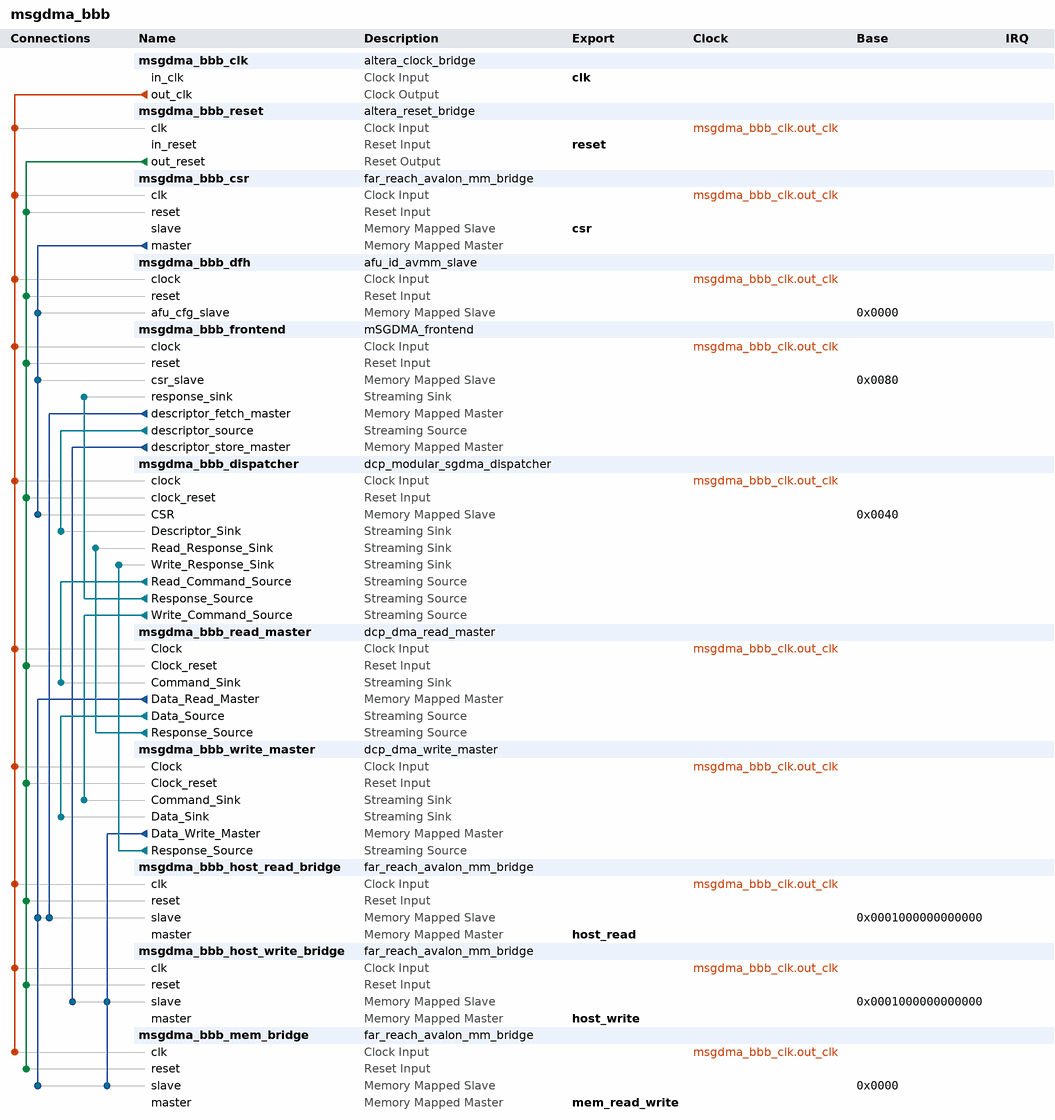
[diagram p0: system contents]
# Platform Designer (Qsys) system msgdma_bbb, Stratix 10 1SX280HN2F43E2VG
# Parameters at their usual value, and those the tool derives, are not listed.
package require -exact qsys 1.0
create_system msgdma_bbb
set_project_property DEVICE_FAMILY {Stratix 10}
set_project_property DEVICE 1SX280HN2F43E2VG

add_component msgdma_bbb_clk ip/msgdma_bbb/msgdma_bbb_clk.ip altera_clock_bridge msgdma_bbb_clk 19.1
load_component msgdma_bbb_clk
set_component_parameter_value DERIVED_CLOCK_RATE 250000000
set_component_parameter_value EXPLICIT_CLOCK_RATE 0
save_component

add_component msgdma_bbb_reset ip/msgdma_bbb/msgdma_bbb_reset.ip altera_reset_bridge msgdma_bbb_reset 17.1
load_component msgdma_bbb_reset
set_component_parameter_value ACTIVE_LOW_RESET 0
set_component_parameter_value SYNCHRONOUS_EDGES both
set_component_parameter_value SYNC_RESET 0
save_component

add_component msgdma_bbb_csr ip/msgdma_bbb/msgdma_bbb_csr.ip far_reach_avalon_mm_bridge msgdma_bbb_csr 1.0
load_component msgdma_bbb_csr
set_component_parameter_value DATA_WIDTH 64
set_component_parameter_value ADDRESS_WIDTH 8
set_component_parameter_value BURST_COUNT 1
set_component_parameter_value BURST_WIDTH 1
set_component_parameter_value RESPONSE_ENABLE 0
set_component_parameter_value READ_ENABLE 1
set_component_parameter_value MAX_PENDING_READS 4
set_component_parameter_value WRITE_ENABLE 1
set_component_parameter_value MAX_PENDING_WRITES 64
set_component_parameter_value WRITE_TRACKING_ENABLE 0
set_component_parameter_value DOWNSTREAM_PIPELINE_STAGES 1
set_component_parameter_value WAITREQUEST_PIPELINE_STAGES 1
set_component_parameter_value UPSTREAM_PIPELINE_STAGES 1
set_component_parameter_value SKID_FIFO_DEPTH 8
set_component_parameter_value SKID_FIFO_ALMOST_FULL_LEVEL 5
set_component_parameter_value SKID_FIFO_CLOCK_CROSSING_ENABLE 0
set_component_parameter_value UPSTREAM_CLOCK_CROSSING_ENABLE 0
set_component_parameter_value UPSTREAM_FIFO_DEPTH 32
set_component_parameter_value UPSTREAM_FIFO_ALMOST_FULL_LEVEL 10
save_component

add_component msgdma_bbb_dfh ip/msgdma_bbb/msgdma_bbb_dfh.ip afu_id_avmm_slave msgdma_bbb_dfh 1.0
load_component msgdma_bbb_dfh
set_component_parameter_value AFU_ID_H 17258601878618128636
set_component_parameter_value AFU_ID_L 12183532447502041578
set_component_parameter_value DFH_FEATURE_TYPE 2
set_component_parameter_value DFH_AFU_MINOR_REV 0
set_component_parameter_value DFH_AFU_MAJOR_REV 0
set_component_parameter_value DFH_END_OF_LIST 0
set_component_parameter_value DFH_NEXT_OFFSET 256
set_component_parameter_value DFH_FEATURE_ID 0
set_component_parameter_value NEXT_AFU_OFFSET 0
set_component_parameter_value CREATE_SCRATCH_REG 0
save_component

add_component msgdma_bbb_frontend ip/msgdma_bbb/msgdma_bbb_frontend.ip mSGDMA_frontend msgdma_bbb_frontend 1.0
load_component msgdma_bbb_frontend
set_component_parameter_value ADDRESS_WIDTH 49
set_component_parameter_value BURST_WIDTH 3
set_component_parameter_value FETCH_FIFO_DEPTH_LOG2 7
set_component_parameter_value STORE_FIFO_DEPTH_LOG2 5
set_component_parameter_value IRQ_ENABLE 0
save_component

add_component msgdma_bbb_dispatcher ip/msgdma_bbb/msgdma_bbb_dispatcher.ip dcp_modular_sgdma_dispatcher msgdma_bbb_dispatcher 17.0
load_component msgdma_bbb_dispatcher
set_component_parameter_value PREFETCHER_USE_CASE 1
set_component_parameter_value MODE 0
set_component_parameter_value GUI_RESPONSE_PORT 0
set_component_parameter_value RESPONSE_PORT 1
set_component_parameter_value DESCRIPTOR_INTERFACE 1
set_component_parameter_value DESCRIPTOR_FIFO_DEPTH 128
set_component_parameter_value ENHANCED_FEATURES 1
set_component_parameter_value DESCRIPTOR_WIDTH 256
set_component_parameter_value DESCRIPTOR_BYTEENABLE_WIDTH 32
set_component_parameter_value CSR_ADDRESS_WIDTH 3
set_component_parameter_value DATA_WIDTH 32
set_component_parameter_value DATA_WIDTH_DERIVED 2
set_component_parameter_value DATA_FIFO_DEPTH 32
set_component_parameter_value DATA_FIFO_DEPTH_DERIVED 1
set_component_parameter_value MAX_BYTE 1024
set_component_parameter_value MAX_BYTE_DERIVED 0
set_component_parameter_value TRANSFER_TYPE {Aligned Accesses}
set_component_parameter_value TRANSFER_TYPE_DERIVED 1
set_component_parameter_value BURST_ENABLE 0
set_component_parameter_value MAX_BURST_COUNT 2
set_component_parameter_value MAX_BURST_COUNT_DERIVED 0
set_component_parameter_value BURST_WRAPPING_SUPPORT 0
set_component_parameter_value STRIDE_ENABLE 0
set_component_parameter_value STRIDE_ENABLE_DERIVED 0
set_component_parameter_value MAX_STRIDE 1
set_component_parameter_value MAX_STRIDE_DERIVED 0
set_component_parameter_value PROGRAMMABLE_BURST_ENABLE 0
set_component_parameter_value CHANNEL_ENABLE 0
set_component_parameter_value CHANNEL_WIDTH 8
set_component_parameter_value CHANNEL_WIDTH_DERIVED 7
set_component_parameter_value ERROR_ENABLE 0
set_component_parameter_value ERROR_WIDTH 8
set_component_parameter_value ERROR_WIDTH_DERIVED 7
set_component_parameter_value PACKET_ENABLE 0
set_component_parameter_value DESCRIPTOR_FIFO_DEPTH_DERIVED 4
save_component

add_component msgdma_bbb_read_master ip/msgdma_bbb/msgdma_bbb_read_master.ip dcp_dma_read_master msgdma_bbb_read_master 17.1
load_component msgdma_bbb_read_master
set_component_parameter_value DATA_WIDTH 512
set_component_parameter_value LENGTH_WIDTH 31
set_component_parameter_value FIFO_DEPTH 128
set_component_parameter_value USE_FIX_ADDRESS_WIDTH 1
set_component_parameter_value FIX_ADDRESS_WIDTH 49
set_component_parameter_value STRIDE_ENABLE 0
set_component_parameter_value GUI_STRIDE_WIDTH 1
set_component_parameter_value BURST_ENABLE 1
set_component_parameter_value GUI_MAX_BURST_COUNT 4
set_component_parameter_value GUI_PROGRAMMABLE_BURST_ENABLE 0
set_component_parameter_value GUI_BURST_WRAPPING_SUPPORT 1
set_component_parameter_value TRANSFER_TYPE {Full Word Accesses Only}
set_component_parameter_value PACKET_ENABLE 0
set_component_parameter_value ERROR_ENABLE 0
set_component_parameter_value ERROR_WIDTH 8
set_component_parameter_value CHANNEL_ENABLE 0
set_component_parameter_value CHANNEL_WIDTH 8
set_component_parameter_value BYTE_ENABLE_WIDTH 64
set_component_parameter_value BYTE_ENABLE_WIDTH_LOG2 6
set_component_parameter_value ADDRESS_WIDTH 49
set_component_parameter_value FIFO_DEPTH_LOG2 7
set_component_parameter_value SYMBOL_WIDTH 8
set_component_parameter_value NUMBER_OF_SYMBOLS 64
set_component_parameter_value NUMBER_OF_SYMBOLS_LOG2 6
set_component_parameter_value MAX_BURST_COUNT_WIDTH 3
set_component_parameter_value UNALIGNED_ACCESSES_ENABLE 0
set_component_parameter_value ONLY_FULL_ACCESS_ENABLE 1
set_component_parameter_value BURST_WRAPPING_SUPPORT 1
set_component_parameter_value PROGRAMMABLE_BURST_ENABLE 0
set_component_parameter_value MAX_BURST_COUNT 4
set_component_parameter_value FIFO_SPEED_OPTIMIZATION 1
set_component_parameter_value STRIDE_WIDTH 1
save_component

add_component msgdma_bbb_write_master ip/msgdma_bbb/msgdma_bbb_write_master.ip dcp_dma_write_master msgdma_bbb_write_master 17.0
load_component msgdma_bbb_write_master
set_component_parameter_value DATA_WIDTH 512
set_component_parameter_value GUI_NO_BYTEENABLES 1
set_component_parameter_value LENGTH_WIDTH 32
set_component_parameter_value FIFO_DEPTH 128
set_component_parameter_value USE_FIX_ADDRESS_WIDTH 1
set_component_parameter_value FIX_ADDRESS_WIDTH 49
set_component_parameter_value STRIDE_ENABLE 0
set_component_parameter_value GUI_STRIDE_WIDTH 1
set_component_parameter_value BURST_ENABLE 1
set_component_parameter_value GUI_MAX_BURST_COUNT 4
set_component_parameter_value GUI_PROGRAMMABLE_BURST_ENABLE 0
set_component_parameter_value GUI_BURST_WRAPPING_SUPPORT 1
set_component_parameter_value TRANSFER_TYPE {Full Word Accesses Only}
set_component_parameter_value PACKET_ENABLE 0
set_component_parameter_value ERROR_ENABLE 0
set_component_parameter_value ERROR_WIDTH 8
set_component_parameter_value BYTE_ENABLE_WIDTH 64
set_component_parameter_value BYTE_ENABLE_WIDTH_LOG2 6
set_component_parameter_value NO_BYTEENABLES 0
set_component_parameter_value ADDRESS_WIDTH 49
set_component_parameter_value FIFO_DEPTH_LOG2 7
set_component_parameter_value SYMBOL_WIDTH 8
set_component_parameter_value NUMBER_OF_SYMBOLS 64
set_component_parameter_value NUMBER_OF_SYMBOLS_LOG2 6
set_component_parameter_value MAX_BURST_COUNT_WIDTH 3
set_component_parameter_value UNALIGNED_ACCESSES_ENABLE 0
set_component_parameter_value ONLY_FULL_ACCESS_ENABLE 1
set_component_parameter_value BURST_WRAPPING_SUPPORT 1
set_component_parameter_value PROGRAMMABLE_BURST_ENABLE 0
set_component_parameter_value MAX_BURST_COUNT 4
set_component_parameter_value FIFO_SPEED_OPTIMIZATION 1
set_component_parameter_value STRIDE_WIDTH 1
set_component_parameter_value ACTUAL_BYTES_TRANSFERRED_WIDTH 32
save_component

add_component msgdma_bbb_host_read_bridge ip/msgdma_bbb/msgdma_bbb_host_read_bridge.ip far_reach_avalon_mm_bridge msgdma_bbb_host_read_bridge 1.0
load_component msgdma_bbb_host_read_bridge
set_component_parameter_value DATA_WIDTH 512
set_component_parameter_value ADDRESS_WIDTH 48
set_component_parameter_value BURST_COUNT 4
set_component_parameter_value BURST_WIDTH 3
set_component_parameter_value RESPONSE_ENABLE 0
set_component_parameter_value READ_ENABLE 1
set_component_parameter_value MAX_PENDING_READS 64
set_component_parameter_value WRITE_ENABLE 0
set_component_parameter_value MAX_PENDING_WRITES 64
set_component_parameter_value WRITE_TRACKING_ENABLE 0
set_component_parameter_value DOWNSTREAM_PIPELINE_STAGES 1
set_component_parameter_value WAITREQUEST_PIPELINE_STAGES 1
set_component_parameter_value UPSTREAM_PIPELINE_STAGES 1
set_component_parameter_value SKID_FIFO_DEPTH 8
set_component_parameter_value SKID_FIFO_ALMOST_FULL_LEVEL 5
set_component_parameter_value SKID_FIFO_CLOCK_CROSSING_ENABLE 0
set_component_parameter_value UPSTREAM_CLOCK_CROSSING_ENABLE 0
set_component_parameter_value UPSTREAM_FIFO_DEPTH 32
set_component_parameter_value UPSTREAM_FIFO_ALMOST_FULL_LEVEL 10
save_component

add_component msgdma_bbb_host_write_bridge ip/msgdma_bbb/msgdma_bbb_host_write_bridge.ip far_reach_avalon_mm_bridge msgdma_bbb_host_write_bridge 1.0
load_component msgdma_bbb_host_write_bridge
set_component_parameter_value DATA_WIDTH 512
set_component_parameter_value ADDRESS_WIDTH 48
set_component_parameter_value BURST_COUNT 4
set_component_parameter_value BURST_WIDTH 3
set_component_parameter_value RESPONSE_ENABLE 1
set_component_parameter_value READ_ENABLE 0
set_component_parameter_value MAX_PENDING_READS 64
set_component_parameter_value WRITE_ENABLE 1
set_component_parameter_value MAX_PENDING_WRITES 64
set_component_parameter_value WRITE_TRACKING_ENABLE 1
set_component_parameter_value DOWNSTREAM_PIPELINE_STAGES 1
set_component_parameter_value WAITREQUEST_PIPELINE_STAGES 1
set_component_parameter_value UPSTREAM_PIPELINE_STAGES 1
set_component_parameter_value SKID_FIFO_DEPTH 8
set_component_parameter_value SKID_FIFO_ALMOST_FULL_LEVEL 5
set_component_parameter_value SKID_FIFO_CLOCK_CROSSING_ENABLE 0
set_component_parameter_value UPSTREAM_CLOCK_CROSSING_ENABLE 0
set_component_parameter_value UPSTREAM_FIFO_DEPTH 32
set_component_parameter_value UPSTREAM_FIFO_ALMOST_FULL_LEVEL 10
save_component

add_component msgdma_bbb_mem_bridge ip/msgdma_bbb/msgdma_bbb_mem_bridge.ip far_reach_avalon_mm_bridge msgdma_bbb_mem_bridge 1.0
load_component msgdma_bbb_mem_bridge
set_component_parameter_value DATA_WIDTH 512
set_component_parameter_value ADDRESS_WIDTH 48
set_component_parameter_value BURST_COUNT 4
set_component_parameter_value BURST_WIDTH 3
set_component_parameter_value RESPONSE_ENABLE 0
set_component_parameter_value READ_ENABLE 1
set_component_parameter_value MAX_PENDING_READS 64
set_component_parameter_value WRITE_ENABLE 1
set_component_parameter_value MAX_PENDING_WRITES 64
set_component_parameter_value WRITE_TRACKING_ENABLE 0
set_component_parameter_value DOWNSTREAM_PIPELINE_STAGES 1
set_component_parameter_value WAITREQUEST_PIPELINE_STAGES 1
set_component_parameter_value UPSTREAM_PIPELINE_STAGES 1
set_component_parameter_value SKID_FIFO_DEPTH 8
set_component_parameter_value SKID_FIFO_ALMOST_FULL_LEVEL 5
set_component_parameter_value SKID_FIFO_CLOCK_CROSSING_ENABLE 0
set_component_parameter_value UPSTREAM_CLOCK_CROSSING_ENABLE 0
set_component_parameter_value UPSTREAM_FIFO_DEPTH 32
set_component_parameter_value UPSTREAM_FIFO_ALMOST_FULL_LEVEL 10
save_component

# connections
add_connection msgdma_bbb_clk.out_clk msgdma_bbb_csr.clk clock
add_connection msgdma_bbb_clk.out_clk msgdma_bbb_dfh.clock clock
add_connection msgdma_bbb_clk.out_clk msgdma_bbb_dispatcher.clock clock
add_connection msgdma_bbb_clk.out_clk msgdma_bbb_frontend.clock clock
add_connection msgdma_bbb_clk.out_clk msgdma_bbb_host_read_bridge.clk clock
add_connection msgdma_bbb_clk.out_clk msgdma_bbb_host_write_bridge.clk clock
add_connection msgdma_bbb_clk.out_clk msgdma_bbb_mem_bridge.clk clock
add_connection msgdma_bbb_clk.out_clk msgdma_bbb_read_master.Clock clock
add_connection msgdma_bbb_clk.out_clk msgdma_bbb_reset.clk clock
add_connection msgdma_bbb_clk.out_clk msgdma_bbb_write_master.Clock clock
add_connection msgdma_bbb_reset.out_reset msgdma_bbb_csr.reset reset
add_connection msgdma_bbb_reset.out_reset msgdma_bbb_dfh.reset reset
add_connection msgdma_bbb_reset.out_reset msgdma_bbb_dispatcher.clock_reset reset
add_connection msgdma_bbb_reset.out_reset msgdma_bbb_frontend.reset reset
add_connection msgdma_bbb_reset.out_reset msgdma_bbb_host_read_bridge.reset reset
add_connection msgdma_bbb_reset.out_reset msgdma_bbb_host_write_bridge.reset reset
add_connection msgdma_bbb_reset.out_reset msgdma_bbb_mem_bridge.reset reset
add_connection msgdma_bbb_reset.out_reset msgdma_bbb_read_master.Clock_reset reset
add_connection msgdma_bbb_reset.out_reset msgdma_bbb_write_master.Clock_reset reset
add_connection msgdma_bbb_csr.master msgdma_bbb_dfh.afu_cfg_slave avalon
set_connection_parameter_value msgdma_bbb_csr.master/msgdma_bbb_dfh.afu_cfg_slave baseAddress 0x0000
add_connection msgdma_bbb_csr.master msgdma_bbb_dispatcher.CSR avalon
set_connection_parameter_value msgdma_bbb_csr.master/msgdma_bbb_dispatcher.CSR baseAddress 0x0040
add_connection msgdma_bbb_csr.master msgdma_bbb_frontend.csr_slave avalon
set_connection_parameter_value msgdma_bbb_csr.master/msgdma_bbb_frontend.csr_slave baseAddress 0x0080
add_connection msgdma_bbb_frontend.descriptor_fetch_master msgdma_bbb_host_read_bridge.slave avalon
set_connection_parameter_value msgdma_bbb_frontend.descriptor_fetch_master/msgdma_bbb_host_read_bridge.slave baseAddress 0x0001000000000000
add_connection msgdma_bbb_frontend.descriptor_store_master msgdma_bbb_host_write_bridge.slave avalon
set_connection_parameter_value msgdma_bbb_frontend.descriptor_store_master/msgdma_bbb_host_write_bridge.slave baseAddress 0x0001000000000000
add_connection msgdma_bbb_read_master.Data_Read_Master msgdma_bbb_host_read_bridge.slave avalon
set_connection_parameter_value msgdma_bbb_read_master.Data_Read_Master/msgdma_bbb_host_read_bridge.slave baseAddress 0x0001000000000000
add_connection msgdma_bbb_read_master.Data_Read_Master msgdma_bbb_mem_bridge.slave avalon
set_connection_parameter_value msgdma_bbb_read_master.Data_Read_Master/msgdma_bbb_mem_bridge.slave baseAddress 0x0000
add_connection msgdma_bbb_write_master.Data_Write_Master msgdma_bbb_host_write_bridge.slave avalon
set_connection_parameter_value msgdma_bbb_write_master.Data_Write_Master/msgdma_bbb_host_write_bridge.slave baseAddress 0x0001000000000000
add_connection msgdma_bbb_write_master.Data_Write_Master msgdma_bbb_mem_bridge.slave avalon
set_connection_parameter_value msgdma_bbb_write_master.Data_Write_Master/msgdma_bbb_mem_bridge.slave baseAddress 0x0000
add_connection msgdma_bbb_dispatcher.Read_Command_Source msgdma_bbb_read_master.Command_Sink avalon_streaming
add_connection msgdma_bbb_dispatcher.Response_Source msgdma_bbb_frontend.response_sink avalon_streaming
add_connection msgdma_bbb_dispatcher.Write_Command_Source msgdma_bbb_write_master.Command_Sink avalon_streaming
add_connection msgdma_bbb_frontend.descriptor_source msgdma_bbb_dispatcher.Descriptor_Sink avalon_streaming
add_connection msgdma_bbb_read_master.Data_Source msgdma_bbb_write_master.Data_Sink avalon_streaming
add_connection msgdma_bbb_read_master.Response_Source msgdma_bbb_dispatcher.Read_Response_Sink avalon_streaming
add_connection msgdma_bbb_write_master.Response_Source msgdma_bbb_dispatcher.Write_Response_Sink avalon_streaming

# exported interfaces
add_interface clk clock sink
set_interface_property clk EXPORT_OF msgdma_bbb_clk.in_clk
add_interface csr avalon slave
set_interface_property csr EXPORT_OF msgdma_bbb_csr.slave
add_interface host_read avalon master
set_interface_property host_read EXPORT_OF msgdma_bbb_host_read_bridge.master
add_interface host_write avalon master
set_interface_property host_write EXPORT_OF msgdma_bbb_host_write_bridge.master
add_interface mem_read_write avalon master
set_interface_property mem_read_write EXPORT_OF msgdma_bbb_mem_bridge.master
add_interface reset reset sink
set_interface_property reset EXPORT_OF msgdma_bbb_reset.in_reset

save_system msgdma_bbb.qsys
